# Altium schematic sheet MCU.SchDoc
size A4
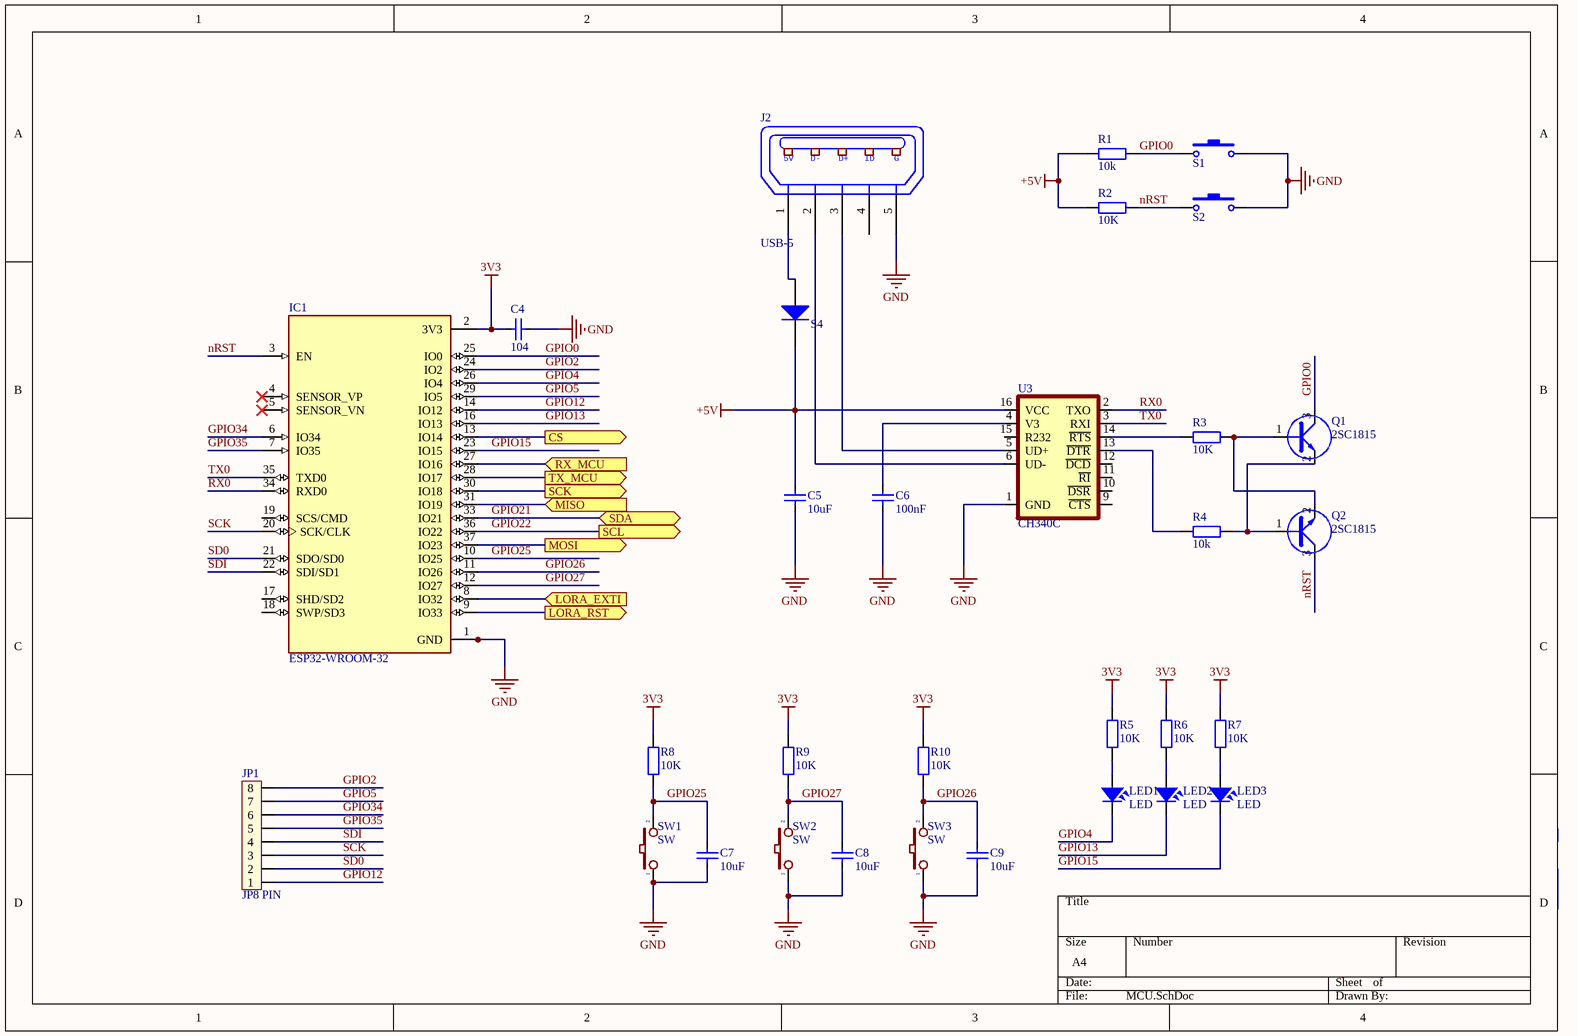
[diagram p0: MCU.SchDoc]

## Parts
?  S4  [DIO-214AC(SMA)]
C4  104  [CAP_0805]
C5  10uF  [CAP_0805]
C6  100nF  [CAP_0805]
C7  10uF  [CAP_0805]
C8  10uF  [CAP_0805]
C9  10uF  [CAP_0805]
IC1  ESP32-WROOM-32  [MODULE_ESP32-WROOM-32]
J2  USB-5  [USB-M1]
JP1  JP8 PIN  [JP8]
LED1  LED  [LED-0805-Blue]
LED2  LED  [LED-0805-Blue]
LED3  LED  [LED-0805-Blue]
Q1  2SC1815  [SOT23D]
Q2  2SC1815  [SOT23D]
R1  10k  [SM-0805]
R2  10K  [SM-0805]
R3  10K  [SM-0805]
R4  10k  [SM-0805]
R5  10K  [RES-SMD-0805]
R6  10K  [RES-SMD-0805]
R7  10K  [RES-SMD-0805]
R8  10K  [RES-SMD-0805]
R9  10K  [RES-SMD-0805]
R10  10K  [RES-SMD-0805]
S1  SW-SMD  [SW-SMD]  (value not drawn)
S2  SW-SMD  [SW-SMD]  (value not drawn)
SW1  SW  [SW2]
SW2  SW  [SW2]
SW3  SW  [SW2]
U3  CH340C  [SOP-16]

## Ports
CS (out), LORA_EXTI (in), LORA_RST (out), MISO (in), MOSI (out), RX_MCU (in), SCK (out), SCL (out), SDA (bidir), TX_MCU (out)

## Nets
3V3: C4.1 IC1.2(3V3) R5.1 R6.1 R7.1 R8.1 R9.1 R10.1
+5V: ?.2(K) C5.1 R1.1 R2.1 U3.16(VCC)
GND: C4.2 C5.2 C6.2 C7.1 C8.1 C9.1 IC1.1(GND) IC1.15(GND) IC1.38(GND) IC1.39_1(GND) IC1.39_2(GND) IC1.39_3(GND) IC1.39_4(GND) IC1.39_5(GND) IC1.39_6(GND) IC1.39_7(GND) IC1.39_8(GND) IC1.39_9(GND) IC1.39_10(GND) IC1.39_11(GND) IC1.39_12(GND) IC1.39_13(GND) IC1.39_14(GND) IC1.39_15(GND) IC1.39_16(GND) IC1.39_17(GND) IC1.39_18(GND) IC1.39_19(GND) IC1.39_20(GND) IC1.39_21(GND) J2.5(P5) S1.2 S2.2 SW1.1 SW2.1 SW3.1 U3.1(GND)
CS: IC1.13(IO14) ; port CS
GPIO0: IC1.25(IO0) Q1.3(C) R1.2 S1.1
GPIO2: IC1.24(IO2) JP1.8
GPIO4: IC1.26(IO4) LED1.2
GPIO5: IC1.29(IO5) JP1.7
GPIO12: IC1.14(IO12) JP1.1
GPIO13: IC1.16(IO13) LED2.2
GPIO15: IC1.23(IO15) LED3.2
GPIO21: IC1.33(IO21) ; port SDA
GPIO22: IC1.36(IO22) ; port SCL
GPIO25: C7.2 IC1.10(IO25) R8.2 SW1.2
GPIO26: C9.2 IC1.11(IO26) R10.2 SW3.2
GPIO27: C8.2 IC1.12(IO27) R9.2 SW2.2
GPIO34: IC1.6(IO34) JP1.6
GPIO35: IC1.7(IO35) JP1.5
LORA_EXTI: IC1.8(IO32) ; port LORA_EXTI
LORA_RST: IC1.9(IO33) ; port LORA_RST
MISO: IC1.31(IO19) ; port MISO
MOSI: IC1.37(IO23) ; port MOSI
nRST: IC1.3(EN) Q2.3(C) R2.2 S2.1
RX0: IC1.34(RXD0) U3.2(TXO)
RX_MCU: IC1.27(IO16) ; port RX_MCU
SCK: IC1.20(SCK/CLK) JP1.3
SCK: IC1.30(IO18) ; port SCK  [a separate net that carries the same name]
SD0: IC1.21(SDO/SD0) JP1.2
SDI: IC1.22(SDI/SD1) JP1.4
TX0: IC1.35(TXD0) U3.3(RXI)
TX_MCU: IC1.28(IO17) ; port TX_MCU
Net?_1: ?.1(A) J2.1(P1)
NetC6_1: C6.1 U3.4(V3)
NetJ2_2: J2.2(P2) U3.6(UD-)
NetJ2_3: J2.3(P3) U3.5(UD+)
NetLED1_1: LED1.1 R5.2
NetLED2_1: LED2.1 R6.2
NetLED3_1: LED3.1 R7.2
NetQ1_1: Q1.1(B) Q2.2(E) R3.2
NetQ1_2: Q1.2(E) Q2.1(B) R4.2
NetR3_1: R3.1 U3.14(~{RTS})
NetR4_1: R4.1 U3.13(~{DTR})

Not connected (* = marked no-connect by the designer): IC1 4(SENSOR_VP)* 5(SENSOR_VN)* 17(SHD/SD2) 18(SWP/SD3) 19(SCS/CMD); J2 4(P4); U3 9(~{CTS}) 10(~{DSR}) 11(~{RI}) 12(~{DCD}) 15(R232)

## Notes on the sheet
- (in symbol USB-5) 5V; D-; D+; ID; G

## Library data of the parts
? = Diode S4: Dán; Ten_Linh_Kien: Diode S4 SOD123 ( 1N5819 SOD123); Ma_Hang: MH005519; Don_Vi: Con; Ghi_Chu: *; Chung_Loai: Dán; Kieu_Chan: *
C4-C9 = CapSMD: Capacitor; Value: 33p; Published: 8-Jun-2000; LatestRevisionDate: 17-Jul-2002; LatestRevisionNote: Re-released for DXP Platform.; PackageReference: RAD-0.3; Publisher: Altium Limited
IC1 = ESP32-WROOM-32: Bluetooth, WiFi Transceiver Module 2.4GHz ~ 2.5GHz Surface Mount; MF: Espressif Systems; Package: Module Espressif Systems; Digi-Key_Part_Number: 1904-1010-1-ND; Digi-Key_Purchase_URL: https://www.digikey.com/product-detail/en/espressif-systems/ESP32-WROOM-32/1904-1010-1-ND/8544305?utm_source=snapeda&utm_medium=aggregator&utm_campaign=symbol; Value: *; MP: ESP32-WROOM-32; SnapEDA_Link: https://www.snapeda.com/parts/ESP32-WROOM-32/Espressif%20Systems/view-part/2753322/?ref=snap
J2 = USB-5: Manufacturer: FCI; Manufacturer Part Number: 10118193-0001LF; Connector Type: USB - micro B; Number of Contacts: 5; Gender: Receptacle; Specifications: USB 2.0; .Creator: MM; .Checked PCB: RF; Supplier 1: Digi-Key; RoHS: RoHS Compliant; Category: Connectors, Interconnects; Stock 1: 28642; Pricing 1: 1=0.46, 10=0.433, 25=0.3712, 50=0.3156, 100=0.3032, 250=0.27224, 500=0.25988 (USD); Packaging: Cut Tape (CT); Mounting Type: Surface Mount, Right Angle, Horizontal; Features: Shielded, Solder Retention; Ingress Protection: -; ComponentLink1URL: http://portal.fciconnect.com/Comergent//fci/drawing/10118193.pdf; ComponentLink1Description: http://portal.fciconnect.com/Comergent//fci/drawing/10118193.pdf; Supplier Part Number 1: 609-4616-1-ND; .Checked SCH: MM
JP1 = JP8: Value: JP7
LED1-LED3 = LED: LED Single colour Green and Red; Value: LED 3 ly Single Colour
Q1 Q2 = C1815: NPN 600mW, ECB; Value: C1815
R1-R4 = RM: Resistor SMD; Value: 1K
R5-R10 = Resistor - SMD: Resistor SMD; Manufacturer: Generic Components; Class: Passive; Published: 08/06/2000; Publisher: Altium Hobart Technology Centre
S1 S2 = SW-SMD: Switch; Published: 24-Mar-1999; LatestRevisionDate: 17-Jul-2002; LatestRevisionNote: Re-released for DXP Platform.; PackageReference: SPST-2; Publisher: Altium Limited
SW1-SW3 = SW2: Switch button 2 pin; Value: SW chip 2 pin
U3 = CH340C: USB to serial chip CH340; MF: WCH; Package: Package; Check_prices: https://www.snapeda.com/parts/CH340C/WCH/view-part/5428851/?ref=eda; Value: *; Price: None; MP: CH340C; Availability: Unavailable; SnapEDA_Link: https://www.snapeda.com/parts/CH340C/WCH/view-part/5428851/?ref=snap